# Altium project PewCB.Blank3x3.PrjPcb
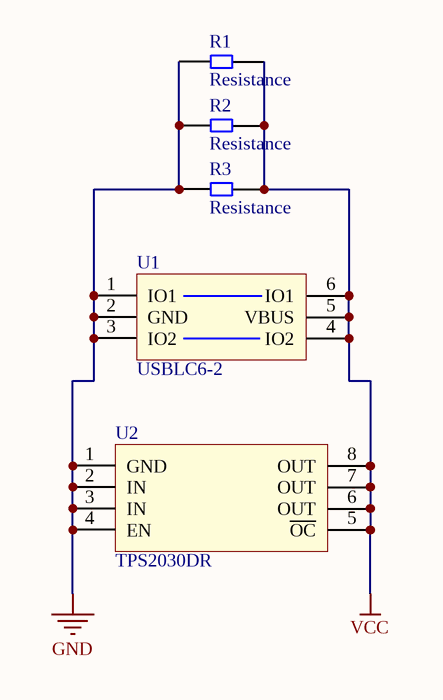
[diagram p0: PewCB.Blank3x3.SchDoc]
1 sheet, 5 parts. Net scope: global (net labels, ports and power ports of the same name join across sheets).
Board file: PewCB.Blank3x3.PcbDoc

## Sheet PewCB.Blank3x3.SchDoc
size A3; SheetNumber: 1; SheetTotal: 1

### Parts
R1  Resistance  [RES_0805]
R2  Resistance  [RES_0805]
R3  Resistance  [RES_0805]
U1  USBLC6-2  [SOT23-6]
U2  TPS2030DR  [SO8]

### Nets
GND: R1.1 R2.1 R3.1 U1.1(IO1) U1.2(GND) U1.3(IO2) U2.1(GND) U2.2(IN) U2.3(IN) U2.4(EN)
VCC: R1.2 R2.2 R3.2 U1.4(IO2) U1.5(VBUS) U1.6(IO1) U2.5(~{OC}) U2.6(OUT) U2.7(OUT) U2.8(OUT)

### Library data of the parts
R1-R3 = Resistor
U1 = USBLC6-2: USB ESD PROTECTION
U2 = TPS2030DR: Power Switch/Driver 1:1 N-Channel 200mA 8-SOIC